# Altium schematic sheet 04_DigitalSensors.SchDoc: Digital Sensors
size A4; SheetNumber: 6; SheetTotal: 10
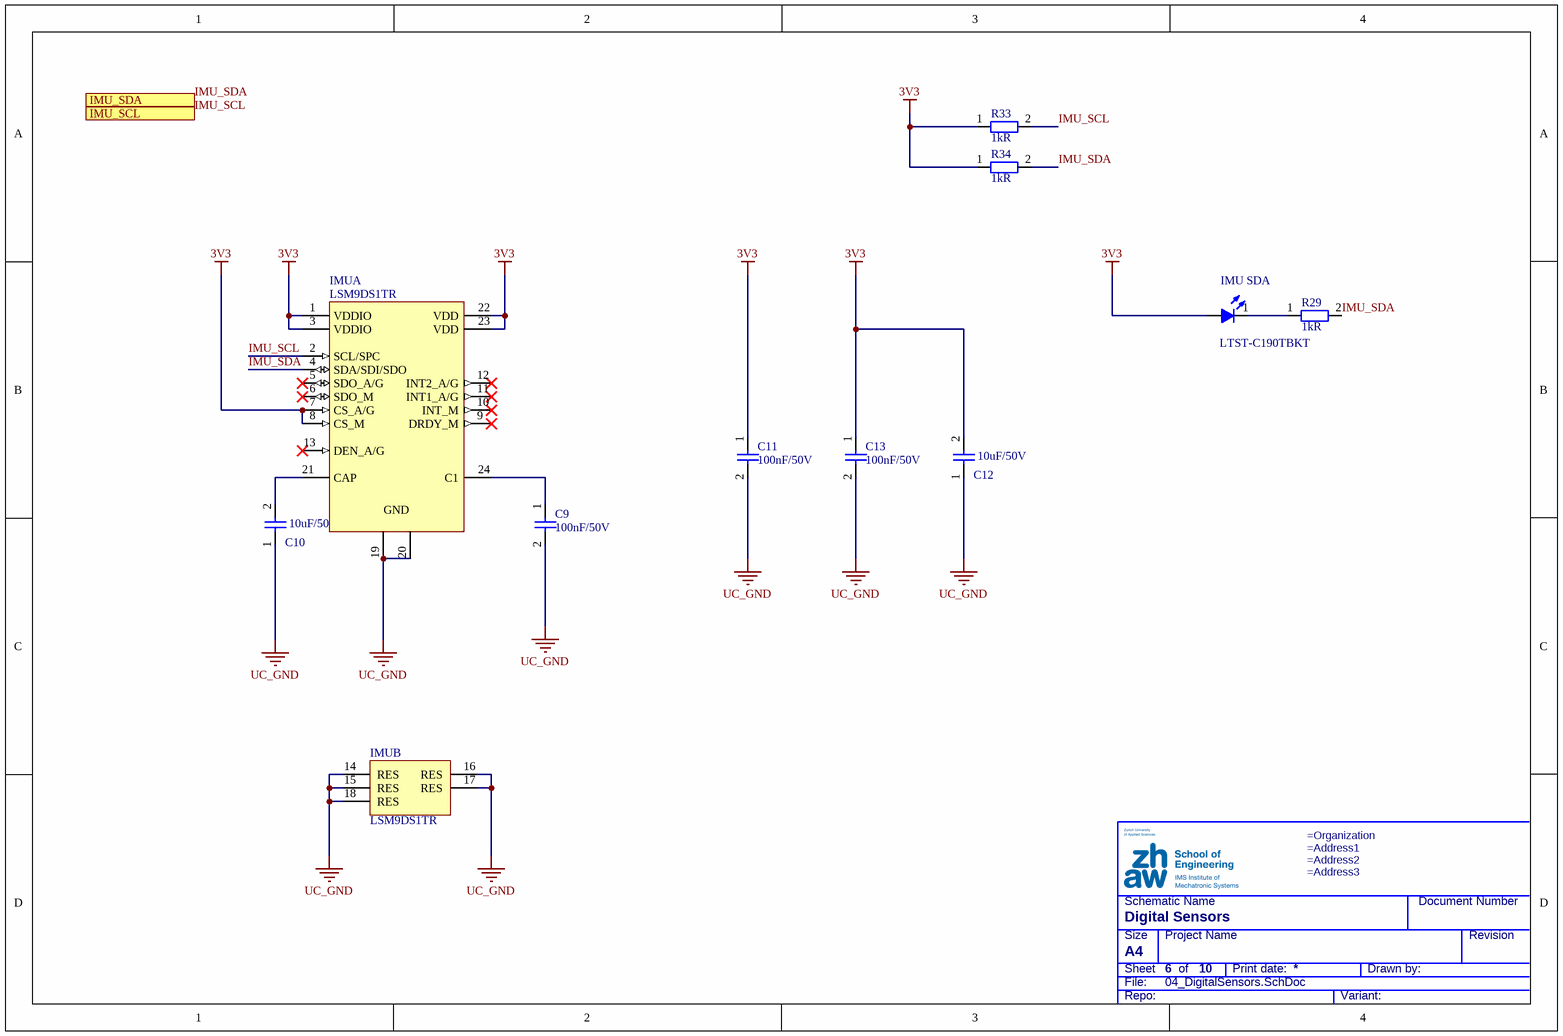
[diagram p0: 04_DigitalSensors.SchDoc]

## Parts
C9  100nF/50V  [CAPC1005X05L]
C10  10uF/50V  [CAPC3216X12L]
C11  100nF/50V  [CAPC1005X05L]
C12  10uF/50V  [CAPC3216X12L]
C13  100nF/50V  [CAPC1005X05L]
IMU  LSM9DS1TR  [LGA24C43P8X6_350X300X103]  (parts A,B of 2)
IMU_SDA  LTST-C190TBKT  [LEDSC160X80X80-2Lbl]
R29  1kR  [RESC1005X04L]
R33  1kR  [RESC1005X04L]
R34  1kR  [RESC1005X04L]

## Ports
IMU_SCL, IMU_SDA

## Nets
3V3: C11.1 C12.2 C13.1 IMU.1(VDDIO) IMU.3(VDDIO) IMU.7(CS_A/G) IMU.8(CS_M) IMU.22(VDD) IMU.23(VDD) IMU_SDA.2(A) R33.1 R34.1
UC_GND: C9.2 C10.1 C11.2 C12.1 C13.2 IMU.14(RES) IMU.15(RES) IMU.16(RES) IMU.17(RES) IMU.18(RES) IMU.19(GND) IMU.20(GND)
IMU_SCL: IMU.2(SCL/SPC) R33.2 ; port IMU_SCL
IMU_SDA: IMU.4(SDA/SDI/SDO) R29.2 R34.2 ; port IMU_SDA
NetC9_1: C9.1 IMU.24(C1)
NetC10_2: C10.2 IMU.21(CAP)
NetIMU_SDA_1: IMU_SDA.1(K) R29.1

Not connected (* = marked no-connect by the designer): IMU 5(SDO_A/G)* 6(SDO_M)* 9(DRDY_M)* 10(INT_M)* 11(INT1_A/G)* 12(INT2_A/G)* 13(DEN_A/G)*

## Notes on the sheet
- Schematic Name
- Document Number
- File:
- Sheet
- Size
- A4
- Project Name
- of
- Print date:
- Drawn by:
- Revision
- Repo:
- Variant:

## Library data of the parts
C9 C11 C13 = CMP-001-00067-18: Cap MLCC, 100nF, 50V, X7R, 10%, 0402; Value: 100nF; Case/Package: 0402; Case Code (Metric): 1005; Dielectricum: X7R; Mounting Technology: SMD; Tolerance: 10%; Type: MLCC; Voltage Rating: 50V
C10 C12 = CMP-001-00092-17: Cap MLCC, 10uF, 50V, X5R, 10%, 1206; Value: 10µF; Case/Package: 1206; Case Code (Metric): 3216; Dielectricum: X5R; Mounting Technology: SMD; Tolerance: 10%; Type: MLCC; Voltage Rating: 50V
IMU = CMP-010-00035-1: Gyroscope+Acceleration+Magnetometer, 9-Axis, 1.9..3.6 V, I2C & SPI, LGA-24; Interface: I2C, SPI; Max Supply Voltage: 3.6V; Min Supply Voltage: 1.9V; Resolution: 16bit; Sensor Type: Gyroscope, Acceleration, Magnetometer, 9-Axis; Sample Rate: -; Case/Package: LGA-24; Mounting Technology: SMD
IMU_SDA = CMP-007-00026-12: LED, Blue, 20mA, 2.8V, 0603; Case/Package: 0603; Color: Blue; Forward Voltage: 2.8V; Mounting Technology: SMD; Rated Current: 20mA; Size: L1.6B0.8H0.8
R29 = CMP-009-00009-32: Res, 1kR, 1%, 0.1W, 0402; Value: 1k; Power: 100mW; Voltage Rating: 50V; Case/Package: 0402; Case Code (Metric): 1005; Mounting Technology: SMD; Tolerance: 1%; Type: Fixed
R33 R34 = CMP-009-00009-32: Res, 1kR, 1%, 0.1W, 0402; Designator: R; Value: 1k; Power: 100mW; Voltage Rating: 50V; Case/Package: 0402; Case Code (Metric): 1005; Mounting Technology: SMD; Tolerance: 1%; Type: Fixed